# Altium schematic sheet LDS3985.SchDoc
size A4
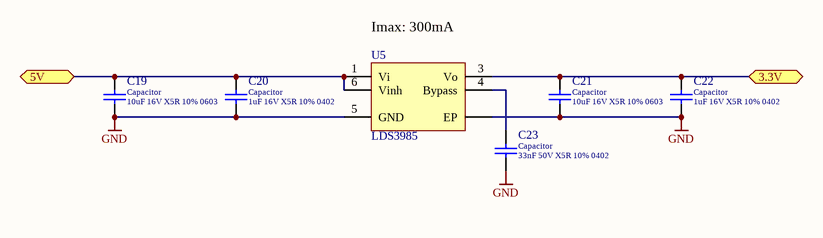
[diagram p0: LDS3985.SchDoc]

## Parts
C19  Capacitor  value 10uF 16V X5R 10% 0603  [0603]
C20  Capacitor  value 1uF 16V X5R 10% 0402  [0402]
C21  Capacitor  value 10uF 16V X5R 10% 0603  [0603]
C22  Capacitor  value 1uF 16V X5R 10% 0402  [0402]
C23  Capacitor  value 33nF 50V X5R 10% 0402  [0402]
U5  LDS3985  [DFN-6-0.95-3x3]

## Ports
3.3V, 5V

## Nets
GND: C19.1 C20.1 C21.1 C22.1 C23.1 U5.0(EP) U5.5(GND)
3.3V: C21.2 C22.2 U5.3(Vo) ; port 3.3V
5V: C19.2 C20.2 U5.1(Vi) U5.6(Vinh) ; port 5V
NetC23_2: C23.2 U5.4(Bypass)

## Notes on the sheet
- (near U5) Imax: 300mA

## Library data of the parts
C19 C21 = Capacitor ceramic: Ceramic capacitor; Voltage: 16V; Tolerance: 10%; Capacitance: 10uF; Dielectric: X5R
C20 C22 = Capacitor ceramic: Ceramic capacitor; Voltage: 16V; Tolerance: 10%; Capacitance: 1uF; Dielectric: X5R
C23 = Capacitor ceramic: Ceramic capacitor; Voltage: 50V; Tolerance: 10%; Capacitance: 33nF; Dielectric: X5R
U5 = LDS3985: 300mA CMOS LDO Regulator in ultra small package